# Altium schematic sheet Temperarute_Sensing_Module.SchDoc
size A4
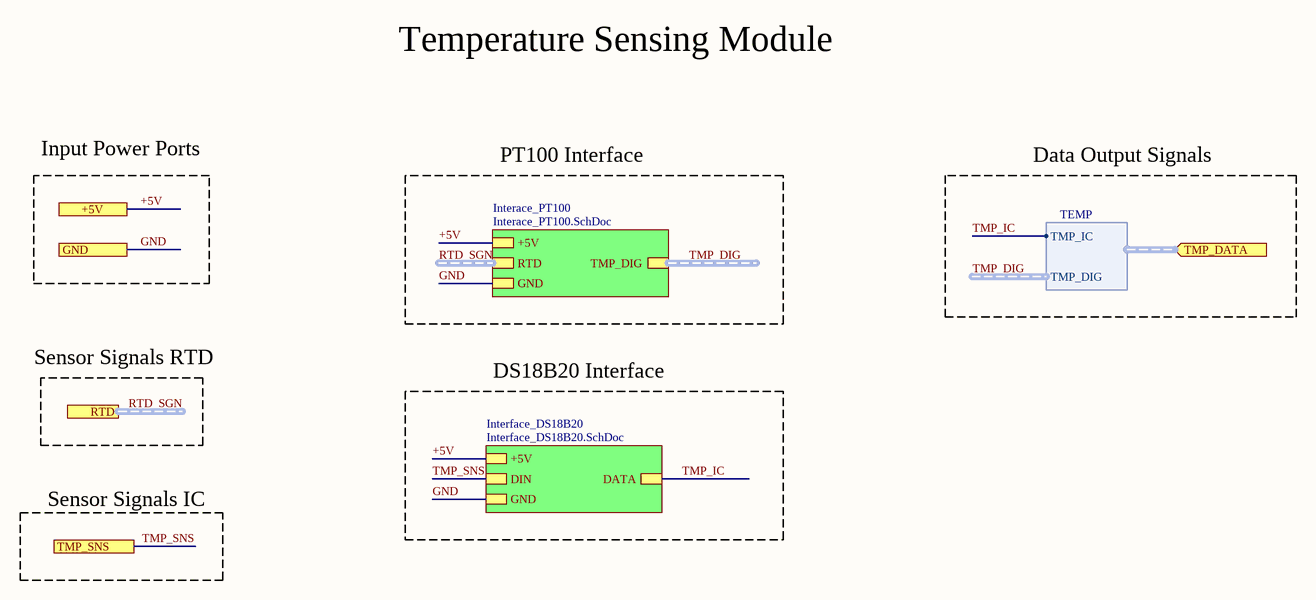
[diagram p0: Temperarute_Sensing_Module.SchDoc]

## Sub-sheets
Interace_PT100 = Interace_PT100.SchDoc: GND, +5V, TMP_DIG (harness TEMP SIGNALS), RTD (harness RTD)
Interface_DS18B20 = Interface_DS18B20.SchDoc: DATA, GND, +5V, DIN

## Ports
+5V, GND, RTD, TMP_DATA (in, harness TEMP), TMP_SNS

## Harnesses
TEMP: TMP_DIG, TMP_IC

## Nets
+5V: port +5V, sheet Interace_PT100/+5V, sheet Interface_DS18B20/+5V
GND: port GND, sheet Interace_PT100/GND, sheet Interface_DS18B20/GND
TMP_IC: sheet Interface_DS18B20/DATA, port TMP_DATA.TMP_IC
TMP_SNS: port TMP_SNS, sheet Interface_DS18B20/DIN

## Buses and harness runs
harness RTD_SGN = port RTD
harness RTD_SGN = sheet Interace_PT100/RTD
harness TMP_DIG = sheet Interace_PT100/TMP_DIG

## Notes on the sheet
- Temperature Sensing Module
- Input Power Ports
- PT100 Interface
- Data Output Signals
- Sensor Signals RTD
- DS18B20 Interface
- Sensor Signals IC